# EAGLE design TinyCharlieCylon (EAGLE 6.5.0)
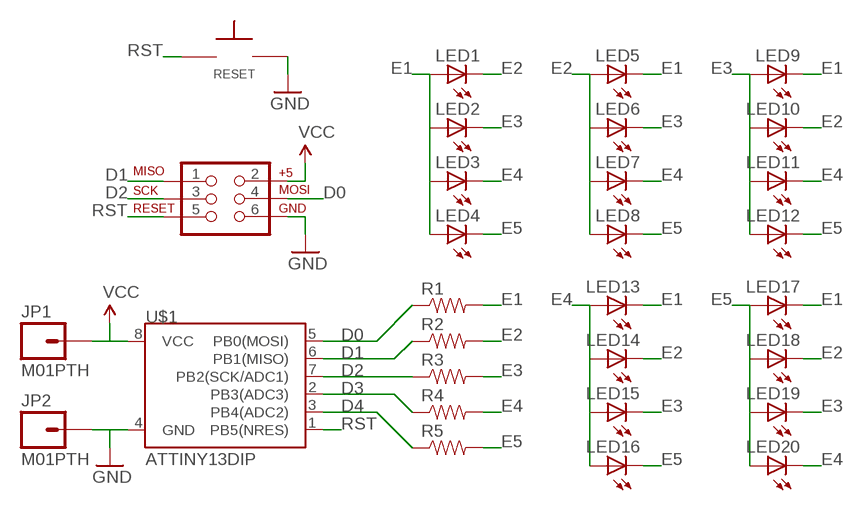
[diagram p0: schematic, sheet 1]

## Parts
J1  AVR_SPI_PRG_6PTH  [2X3]
JP1  M01PTH  [1X01]
JP2  M01PTH  [1X01]
LED1  LED3MM  [LED3MM]
LED2  LED3MM  [LED3MM]
LED3  LED3MM  [LED3MM]
LED4  LED3MM  [LED3MM]
LED5  LED3MM  [LED3MM]
LED6  LED3MM  [LED3MM]
LED7  LED3MM  [LED3MM]
LED8  LED3MM  [LED3MM]
LED9  LED3MM  [LED3MM]
LED10  LED3MM  [LED3MM]
LED11  LED3MM  [LED3MM]
LED12  LED3MM  [LED3MM]
LED13  LED3MM  [LED3MM]
LED14  LED3MM  [LED3MM]
LED15  LED3MM  [LED3MM]
LED16  LED3MM  [LED3MM]
LED17  LED3MM  [LED3MM]
LED18  LED3MM  [LED3MM]
LED19  LED3MM  [LED3MM]
LED20  LED3MM  [LED3MM]
R1  RESISTORAXIAL-0.3  [AXIAL-0.3]
R2  RESISTORAXIAL-0.3  [AXIAL-0.3]
R3  RESISTORAXIAL-0.3  [AXIAL-0.3]
R4  RESISTORAXIAL-0.3  [AXIAL-0.3]
R5  RESISTORAXIAL-0.3  [AXIAL-0.3]
RESET  TAC_SPST_NO  [TAC_SPST_NO]
U$1  ATTINY13DIP  [DIP08]

## Nets
D0: J1.4 R1.P$1 U$1.5(PB0(MOSI))
D1: J1.1 R2.P$1 U$1.6(PB1(MISO))
D2: J1.3 R3.P$1 U$1.7(PB2(SCK/ADC1))
D3: R4.P$1 U$1.2(PB3(ADC3))
D4: R5.P$1 U$1.3(PB4(ADC2))
E1: LED1.A LED2.A LED3.A LED4.A LED5.K(C) LED9.K(C) LED13.K(C) LED17.K(C) R1.P$2
E2: LED1.K(C) LED5.A LED6.A LED7.A LED8.A LED10.K(C) LED14.K(C) LED18.K(C) R2.P$2
E3: LED2.K(C) LED6.K(C) LED9.A LED10.A LED11.A LED12.A LED15.K(C) LED19.K(C) R3.P$2
E4: LED3.K(C) LED7.K(C) LED11.K(C) LED13.A LED14.A LED15.A LED16.A LED20.K(C) R4.P$2
E5: LED4.K(C) LED8.K(C) LED12.K(C) LED16.K(C) LED17.A LED18.A LED19.A LED20.A R5.P$2
GND: J1.6 JP2.1 RESET.P$2 U$1.4(GND)
RST: J1.5 RESET.P$1 U$1.1(PB5(NRES))
VCC: J1.2 JP1.1 U$1.8(VCC)

## Library data of the parts
J1 = barbary_enterprises:AVR_SPI_PRG_6: AVR ISP 6 Pin This is the reduced ISP connector for AVR programming. Common on Arduino. This footprint will take up less PCB space and can be used with a 10-pin to 6-pin adapter such as SKU: BOB-08508
JP1 JP2 = SparkFun-Connectors:M01: Header 1 Standard 1-pin 0.1" header. Use with straight break away headers (SKU : PRT-00116), right angle break away headers (PRT-00553), swiss pins (PRT-00743), machine pins (PRT-00117), and female headers (PRT-00115).
LED1-LED20 = SparkFun-LED:LED: LEDs Standard schematic elements and footprints for 5mm, 3mm, 1206, and 0603 sized LEDs. 5mm - Spark Fun Electronics SKU : COM-00529 (and others)
R1-R5 = SparkFun-Resistors:RESISTOR: Resistor Basic schematic elements and footprints for 0603, 1206, and PTH resistors.
RESET = barbary_enterprises:TAC_SPST_NO: 3,5 mm Tact Switches C&K PTS635 Series * Digi-Key Part Number: CKN9102-ND
U$1 = SparkFun-DigitalIC:ATTINY13: Atmel 8-pin 1kB flash uC

## Board
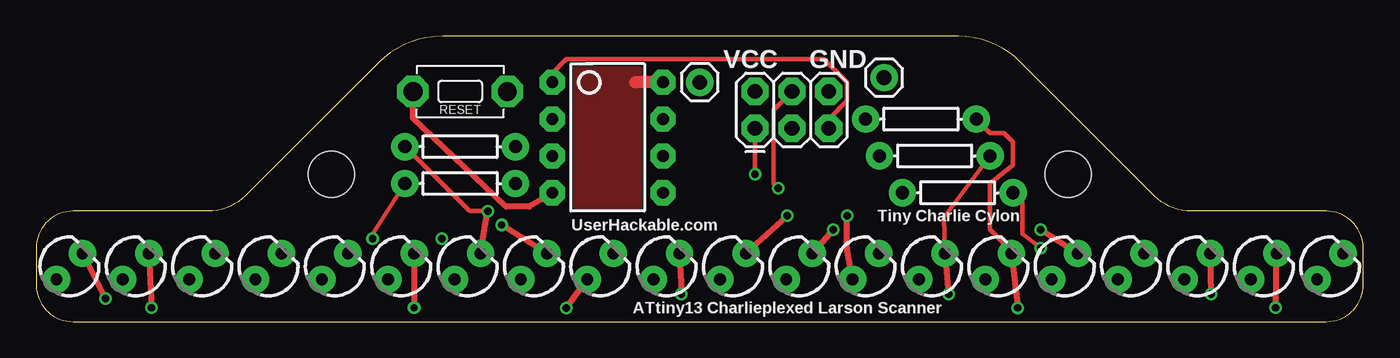
[diagram p1: board, top side]
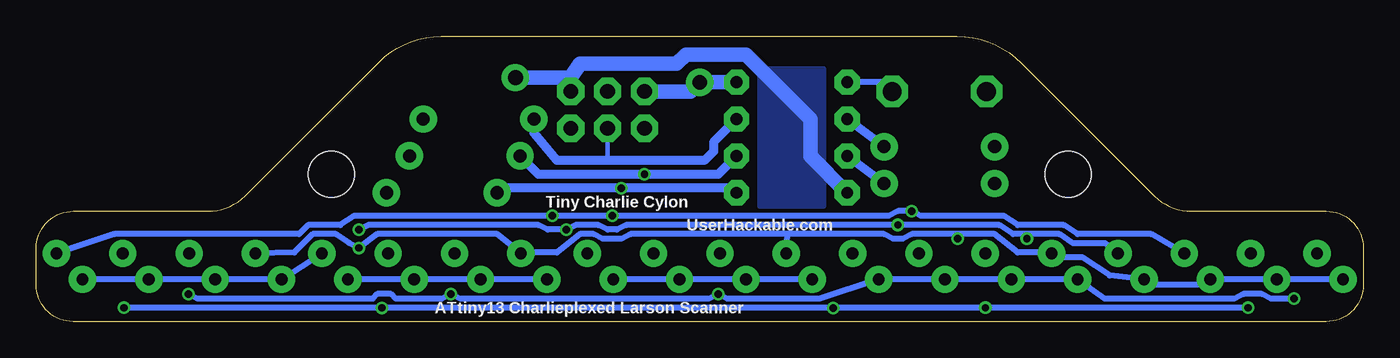
[diagram p2: board, bottom side, seen from below]

Size 91.44 x 19.68 mm. Coordinates in mm from the lower left corner, seen from the top.
Outline: 91.44,2.54 91.44,5.06 arc90 88.88,7.62 79.59,7.62 arc-45 77.05,8.67 67.82,17.91 arc45 63.53,19.68 28,19.68 arc45 23.56,17.84 14.39,8.67 arc-45 11.85,7.62 2.54,7.62 arc90 0,5.08 0,2.54 arc90 2.54,0 88.9,0 arc90 91.44,2.54
Copper layers (1*16): Top 0.0356mm / dielectric 1.5011mm / Bottom 0.0356mm
Design rules "LaenPCBOrder": minimum track width 6mil, minimum drill 13mil, track to track 6mil, track to pad 6mil, pad to pad 6mil, via to via 6mil, smd to smd 6mil, copper to edge 15mil, drill to drill 6mil, minimum pad ring 7mil, minimum via ring 7mil, stop-mask expansion 3mil, vias tented up to drill 0mil, thermal gap 10mil
Holes 3.17 mm at 20.32,10.16 71.12,10.16

### Footprints (pad centres in the part's own frame; a part is rotated, then mirrored left to right if it is on the bottom)
2X3 = drill 1.016 pad 1.88 octagon: 1 0,0; 2 0,2.54; 3 2.54,0; 4 2.54,2.54; 5 5.08,0; 6 5.08,2.54
1X01 = drill 1.016 pad 1.88: 1 0,0
LED3MM = drill 0.813 pad 1.88: A -1.27,0; K 1.27,0
AXIAL-0.3 = drill 0.9 pad 1.88: P$1 -3.81,0; P$2 3.81,0
TAC_SPST_NO = drill 1.3 pad 2.184 octagon: P$1 -3.251,0; P$2 3.251,0
DIP08 = drill 0.813 pad 1.727 octagon: 1 -3.81,-3.81; 2 -1.27,-3.81; 3 1.27,-3.81; 4 3.81,-3.81; 5 3.81,3.81; 6 1.27,3.81; 7 -1.27,3.81; 8 -3.81,3.81

### Placement (x,y rotation side)
J1  49.53,13.34 0 top
JP1  45.72,16.51 0 top
JP2  58.42,16.83 0 top
LED1  2.29,3.81 45 top
LED2  6.86,3.81 45 top
LED3  11.43,3.81 45 top
LED4  16,3.81 45 top
LED5  20.57,3.81 45 top
LED6  25.15,3.81 45 top
LED7  29.72,3.81 45 top
LED8  34.29,3.81 45 top
LED9  38.86,3.81 45 top
LED10  43.43,3.81 45 top
LED11  48.01,3.81 45 top
LED12  52.58,3.81 45 top
LED13  57.15,3.81 45 top
LED14  61.72,3.81 45 top
LED15  66.29,3.81 45 top
LED16  70.87,3.81 45 top
LED17  75.44,3.81 45 top
LED18  80.01,3.81 45 top
LED19  84.58,3.81 45 top
LED20  89.15,3.81 45 top
R1  63.5,8.89 0 top
R2  61.91,11.43 0 top
R3  60.96,13.97 0 top
R4  29.21,12.06 180 top
R5  29.21,9.53 180 top
RESET  29.21,15.88 180 top
U$1  39.37,12.7 270 top

### Tracks (layer width: path | path; a pad name or v marks a point on that pad's centre or on a via)
D0  (via drill 0.51)
  Top 0.305: J1.4 50.8,14.61 50.8,9.53 v51.12,9.21
  Bottom 0.61: U$1.5 43.5,9.21 v51.12,9.21 59.37,9.21 R1.P$1
D1  (via drill 0.51)
  Top 0.305: J1.1 v49.53,10.16
  Bottom 0.61: U$1.6 44.45,10.16 v49.53,10.16 56.83,10.16 R2.P$1
D2
  Bottom 0.305: J1.3 52.07,11.11
  Bottom 0.61: U$1.7 44.77,12.38 44.77,11.75 45.4,11.11 52.07,11.11 55.56,11.11 57.15,13.02 R3.P$1
D3
  Bottom 0.61: R4.P$1 U$1.2
D4
  Bottom 0.61: R5.P$1 U$1.3
E1  (via drill 0.51)
  Top 0.305: R1.P$2 67.94,8.26 67.94,6.03 v69.22,5.08
  Bottom 0.406: LED1.A LED2.A LED3.A 11.43,2.54 14.29,2.54 LED4.A 17.46,3.17 19.37,4.45 20.95,4.45 LED5.K 21.91,4.76 23.81,4.76 25.4,6.03 27.94,6.03 | 27.94,6.03 31.11,6.03 31.75,5.71 32.38,5.71 33.02,6.03 39.69,6.03 | 39.69,6.03 50.48,6.03 51.12,5.71 52.39,5.71 53.02,6.03 53.98,6.03 55.56,4.76 58.1,4.76 | 58.1,4.76 59.69,6.03 67.94,6.03 v69.22,5.08 69.85,5.4 70.8,6.03 72.39,6.03 73.66,4.76 LED17.K | LED9.K 39.69,6.03 | LED13.K 58.1,4.76 | v27.94,5.71 27.94,6.03
E2  (via drill 0.51)
  Top 0.305: LED14.K 62.55,7.18 R2.P$2
  Top 0.406: LED1.K v4.76,1.59 | v80.96,1.91 LED18.K | LED10.K v44.45,1.91 | LED14.K v62.87,1.91
  Bottom 0.406: v4.76,1.59 6.35,1.59 6.99,1.91 8.26,1.91 8.89,1.59 17.78,1.59 LED5.A LED6.A LED7.A LED8.A 37.47,1.59 43.81,1.59 v44.45,1.91 45.09,1.59 62.23,1.59 v62.87,1.91 63.5,1.59 66.67,1.59 66.99,1.91 67.94,1.91 68.26,1.59 80.33,1.59 v80.96,1.91
E3  (via drill 0.51)
  Top 0.305: R3.P$2 65.72,13.02 66.67,13.02 67.31,12.38 67.31,10.79 65.72,9.53 65.72,6.35 67.19,4.88 LED15.K
  Top 0.406: LED9.A 36.51,0.95 v36.51,0.94 | LED2.K v7.94,0.95 | v85.41,0.95 LED19.K | LED6.K v26.04,0.95 | LED15.K v67.63,0.95
  Bottom 0.406: LED9.A LED10.A LED11.A LED12.A | v7.94,0.95 v26.04,0.95 36.51,0.95 v36.51,0.94 v67.63,0.95 71.12,0.95 v85.41,0.95
E4  (via drill 0.51)
  Top 0.305: R4.P$2 29.84,7.62 v31.11,7.62
  Top 0.406: LED7.K v31.11,7.62 | LED11.K v51.75,7.3 | LED13.A 55.88,5.08 v55.88,7.3
  Bottom 0.406: LED13.A LED14.A LED15.A LED16.A | LED3.K 14.61,6.03 19.68,6.03 20.64,6.67 23.81,6.67 24.77,7.3 30.48,7.3 v31.11,7.62 32.07,7.62 32.7,7.3 v51.75,7.3 v55.88,7.3 69.53,7.3 70.48,6.67 72.71,6.67 73.34,6.03 86.04,6.03 LED20.K
E5  (via drill 0.51)
  Top 0.305: R5.P$2 23.18,6.03 v23.18,5.71
  Top 0.406: v69.22,6.35 LED16.K | LED8.K v32.07,6.67 | LED12.K v54.93,6.35
  Bottom 0.305: v23.18,5.71 23.18,6.03
  Bottom 0.406: LED20.A LED19.A LED18.A LED17.A LED16.K | LED4.K 17.78,5.4 20,5.4 20.95,6.03 23.18,6.03 24.13,6.03 25.08,6.67 v32.07,6.67 50.8,6.67 51.44,6.35 52.07,6.35 52.7,6.67 54.29,6.67 v54.93,6.35 56.2,6.35 56.83,6.67 68.58,6.67 v69.22,6.35
GND
  Top 0.406: U$1.4 33.97,7.94 32.38,7.94 25.96,14.05 RESET.P$2
  Bottom 1.016: U$1.4 38.1,11.43 38.1,13.97 42.55,18.41 46.67,18.41 47.31,17.78 53.98,17.78 54.61,16.83 | J1.6 54.61,16.83 | JP2.1 54.61,16.83
  pour Bottom: 37.15,7.94 41.59,7.94 41.59,17.46 37.15,17.46
RST
  Top 0.305: J1.5 54.61,13.97 55.88,15.24 55.88,16.51 54.29,18.1 36.51,18.1 35.56,17.14 U$1.1
  Bottom 0.406: RESET.P$1 33.1,16.51 U$1.1
VCC
  Top 0.813: U$1.8 41.27,16.51
  Bottom 1.016: U$1.8 JP1.1 46.35,15.88 J1.2
  pour Top: 37.15,7.94 41.59,7.94 41.59,17.46 37.15,17.46

### Text on the board
tPlace: VCC | GND | UserHackable.com | Tiny Charlie Cylon | ATtiny13 Charlieplexed Larson Scanner
bPlace: Tiny Charlie Cylon | UserHackable.com | ATtiny13 Charlieplexed Larson Scanner